# Altium schematic sheet Power_Synth.SchDoc
size A4; SheetNumber: 1; SheetTotal: 1
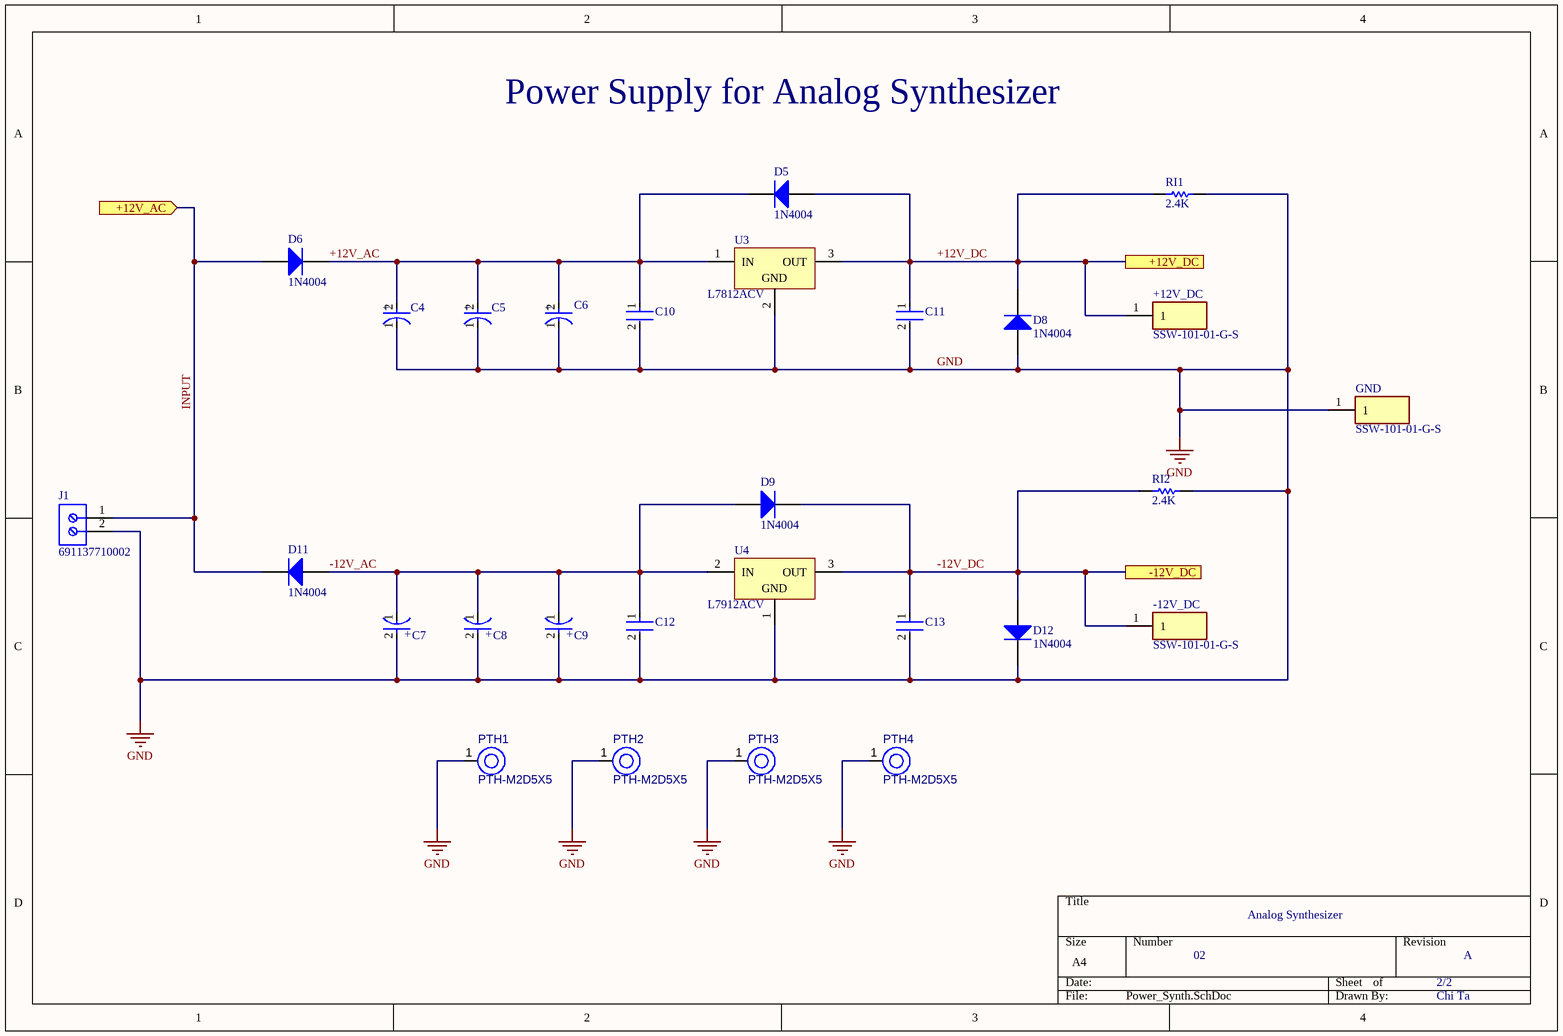
[diagram p0: Power_Synth.SchDoc]

## Parts
+12V_DC  SSW-101-01-G-S  [SSW-101-XX-YYY-S]
-12V_DC  SSW-101-01-G-S  [SSW-101-XX-YYY-S]
C4  3300uF  [FP-RAD-TH-D_18_0_5-L_35_5-MFG]  (value not drawn)
C5  3300uF  [FP-RAD-TH-D_18_0_5-L_35_5-MFG]  (value not drawn)
C6  3300uF  [FP-RAD-TH-D_18_0_5-L_35_5-MFG]  (value not drawn)
C7  3300uF  [FP-RAD-TH-D_18_0_5-L_35_5-MFG]  (value not drawn)
C8  3300uF  [FP-RAD-TH-D_18_0_5-L_35_5-MFG]  (value not drawn)
C9  3300uF  [FP-RAD-TH-D_18_0_5-L_35_5-MFG]  (value not drawn)
C10  1uF  [FP-R82DC4100DQ60J-MFG]  (value not drawn)
C11  1uF  [FP-R82DC4100DQ60J-MFG]  (value not drawn)
C12  1uF  [FP-R82DC4100DQ60J-MFG]  (value not drawn)
C13  1uF  [FP-R82DC4100DQ60J-MFG]  (value not drawn)
D5  1N4004  [FAIR-DO-41-2]
D6  1N4004  [FAIR-DO-41-2]
D8  1N4004  [FAIR-DO-41-2]
D9  1N4004  [FAIR-DO-41-2]
D11  1N4004  [FAIR-DO-41-2]
D12  1N4004  [FAIR-DO-41-2]
GND  SSW-101-01-G-S  [SSW-101-XX-YYY-S]
J1  691137710002  [691137710002]
PTH1  PTH-M2D5X5  [PTH-M2D5X5]
PTH2  PTH-M2D5X5  [PTH-M2D5X5]
PTH3  PTH-M2D5X5  [PTH-M2D5X5]
PTH4  PTH-M2D5X5  [PTH-M2D5X5]
RI1  2.4K  [RESA60-630X240]
RI2  2.4K  [RESA60-630X240]
U3  L7812ACV  [TO220]
U4  L7912ACV  [TO220]

## Ports
+12V_AC (in), +12V_DC, -12V_DC

## Nets
GND: C4.1(C) C5.1(C) C6.1(C) C7.2(A) C8.2(A) C9.2(A) C10.2 C11.2 C12.2 C13.2 D8.1(A) D12.2(K) GND.1 J1.2 PTH1.1(H1) PTH2.1(H1) PTH3.1(H1) PTH4.1(H1) RI1.1 RI2.1 U3.2(GND) U4.1(GND)
+12V_AC: C4.2(A) C5.2(A) C6.2(A) C10.1 D5.2(K) D6.2(K) U3.1(IN)
+12V_DC: +12V_DC.1 C11.1 D5.1(A) D8.2(K) RI1.2 U3.3(OUT) ; port +12V_DC
-12V_AC: C7.1(C) C8.1(C) C9.1(C) C12.1 D9.1(A) D11.1(A) U4.2(IN)
-12V_DC: -12V_DC.1 C13.1 D9.2(K) D12.1(A) RI2.2 U4.3(OUT) ; port -12V_DC
INPUT: D6.1(A) D11.2(K) J1.1 ; port +12V_AC

## Notes on the sheet
- Power Supply for Analog Synthesizer
- Analog Synthesizer
- 02
- 2/2
- A
- Chi Ta
- (in symbol CMP-05427-000162-1) +

## Library data of the parts
+12V_DC -12V_DC GND = SSW-101-01-G-S: Connector; Manufacturer_Name: SAMTEC; Datasheet Link: http://suddendocs.samtec.com/prints/ssw-1xx-xx-xxx-x-xx-xxx-xx-mkt.pdf; Height: 8.51mm; Manufacturer_Part_Number: SSW-101-01-G-S; Mouser Part Number: 200-SSW10101GS; Mouser Price/Stock: https://www.mouser.co.uk/ProductDetail/Samtec/SSW-101-01-G-S?qs=rU5fayqh%252BE20ZXdRgwMbIg%3D%3D; Arrow Part Number: SSW-101-01-G-S; Arrow Price/Stock: https://www.arrow.com/en/products/ssw-101-01-g-s/samtec
C4-C9 = CMP-05427-000162-1: Aluminum Electrolytic Capacitors (Radial Lead Type) AEC-Q200 Qualified 3300uF ±20% 35V; Ripple Current: 3.68A; Life (Hours): 5000Hour; Impedance: 15mR; Leakage Current: 3uA; Capacitance: 3.3mF; Lead Diameter: 0.8mm; Radiation Hardening: No; Number of Pins: 2; REACH SVHC: No SVHC; Features: General Purpose; Mount: Through Hole; RoHS Compliant: Yes; Max Operating Temperature: 105°C; Case/Package: Radial; Tolerance: 20%; Lead Free: Lead Free; Package Quantity: 50; Packaging: Bulk; Diameter: 18mm; Voltage Rating (DC): 35V; Height: 35.5mm; Length: 35mm; ESR (Equivalent Series Resistance): 15mR; Min Operating Temperature: -55°C; Voltage: 35V; Lead Pitch: 7.5mm; Series: FC; Voltage Rating: 35V; Contact Plating: Tin; Construction: RADIAL; Height - Seated (Max): 1.398inch; Termination: Radial
C10-C13 = CMP-03022-000017-1: CAP FILM 1UF 5% 63VDC RADIAL; Voltage Rating (DC): 63V; Lead Diameter: 0.5mm; Insulation Resistance: 30R; Dielectric: PET; Voltage Rating (AC): 40V; Dissipation Factor: 80%; Life (Hours): 2000Hour; Type: General Purpose; Mount: Through Hole; Case/Package: Radial; Package Quantity: 1700; Construction: RADIAL; Capacitance: 1uF; Lead Pitch: 5mm; Depth: 5mm; Series: R82; Packaging: Tape and Reel; RoHS Compliant: Yes; Voltage Rating: 63V; Height - Seated (Max): 0.398inch; Voltage: 63V; Radiation Hardening: No; Width: 5mm; REACH SVHC: No SVHC; Min Operating Temperature: -55°C; Tolerance: 5%; Dielectric Material: PET; Contact Plating: Tin; Termination: Radial; Length: 7.2mm; Max Operating Temperature: 105°C
D5 D6 D8 D9 D11 D12 = CMP-004-00004-2: General Purpose Rectifier, 400 V, 1 A, -55 to 175 degC, 2-Pin DO-204AL (DO-41), RoHS, Tape and Reel; Manufacturer: Fairchild Semiconductor; Forward Voltage: 1.1V; Forward Current: 1A; Max Surge Current: 30A; Package Version: Rev. 2, 09/2008; Peak Reverse Current: 50A; Case/Package: DO-41-2; Pins: 2; RoHS Compliant: True; Diameter: 2.72mm; Package Reference: DO-41-2; Datasheet URL: https://www.fairchildsemi.com/datasheets/1N/1N4004.pdf; Manufacturer URL: https://www.fairchildsemi.com/; Max Operating Temperature: 175°C; Datasheet Version: Rev. 1.1.0, 11/2014; Package URL: http://www.fairchildsemi.com/dwg/DO/DO41A.pdf; Package Quantity: 5000; Min Operating Temperature: -55°C; Package Description: 2-Pin Axial Lead, Dia 2.375 mm, Body Length 4.63 mm; Mounting Technology: TH; Packaging: TapeandReel
J1 = CMP-1502-03324-2: NexarPartId: 78871135; Voltage Rating: 300V; Number of Contacts: 2; Current Rating: 16A; Lead Pitch: 5mm; Height: 11.6mm; Packaging: Box; RoHS: Non-Compliant; Contact Material: Nickel, Tin; Max Operating Temperature: 120°C; Number of Pins: 2; Min Operating Temperature: -30°C; Number of Rows: 1
PTH1-PTH4 = CMP-00028-00004-2: M2 PTH (2.5mm), 5mm pad; Pins: 1
RI1 RI2 = CMP-1659-00074-2: Axial Resistor, 2.2 KOhm, +/- 1%, 0.25 W, -55 to 155 degC, 2-Pin THD, RoHS, Bulk; Manufacturer: Yageo; Temperature Coefficient: 100ppm\/degreesC; Voltage Rating: 250V; Voltage Rating (DC): 200V; Resistance: 10KOhm; Max Power Dissipation: 250mW; Datasheet URL: http://www.yageo.com/documents/recent/Yageo%20LR_MFR_2013.pdf; Packaging: Bulk; RoHSCompliant: True; Mount: ThroughHole; Package Reference: MFR-25; Termination: Axial; Composition: MetalFilm; Number of Terminations: 2; Package Quantity: 200; Mounting Technology: ThroughHole; Length: 0.248inch; Max Operating Temperature: 155degC; Min Operating Temperature: -55degC; Datasheet Version: 04/2013; Lead Free: LeadFree; Manufacturer URL: http://www.yageo.com/; Tolerance: 1%; Power Rating: 250mW; Package Description: 2-Pin Axial Lead, Dia 2.4 mm, Body Length 6.3 mm; Military Standard: Not; Case\/Package: Axial
U3 = CMP-0244-00451-1: Positive Voltage Regulator, 12V, 3-Pin TO-220; PackageDescription: TO, Thru-Hole, Vertical, Heatsink Mounted; 3 In-Line Leads; Pitch 2.54 mm; ComponentLink3URL: http://www.st.com/internet/com/TECHNICAL_RESOURCES/TECHNICAL_LITERATURE/PACKAGE_INFORMATION/CD00004649.pdf; ComponentLink3Description: Package Specification; DatasheetVersion: 16/11/2011; ComponentLink1Description: Manufacturer URL; PackageVersion: ver3.0; PackageReference: TO220; ComponentLink1URL: http://www.st.com; ComponentLink2Description: Datasheet; ComponentLink2URL: http://www.st.com/internet/com/TECHNICAL_RESOURCES/TECHNICAL_LITERATURE/DATASHEET/CD00000444.pdf
U4 = CMP-0244-00427-1: 2% Negative Voltage Regulator, -12V, 3-Pin TO-220; ComponentLink2Description: Datasheet; PackageReference: TO220; ComponentLink1Description: Manufacturer URL; DatasheetVersion: 1/11/2010; ComponentLink2URL: http://www.st.com/internet/com/TECHNICAL_RESOURCES/TECHNICAL_LITERATURE/DATASHEET/CD00000451.pdf; PackageVersion: ver3.0; ComponentLink3Description: Package Specification; PackageDescription: TO, Thru-Hole, Vertical, Heatsink Mounted; 3 In-Line Leads; Pitch 2.54 mm; ComponentLink3URL: http://www.st.com/internet/com/TECHNICAL_RESOURCES/TECHNICAL_LITERATURE/PACKAGE_INFORMATION/CD00004649.pdf; ComponentLink1URL: http://www.st.com